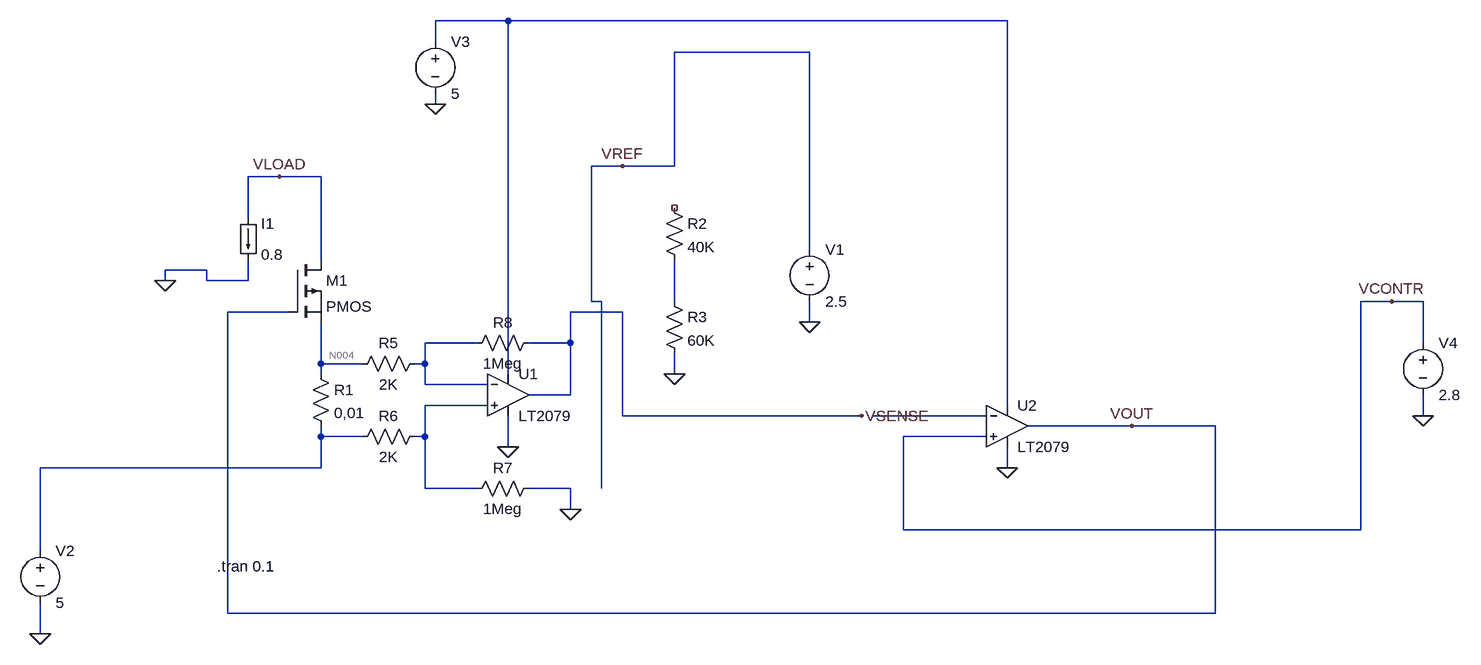
[diagram p0: schematic Draft2.asc]
Draft2.asc, the LTspice schematic file:
Version 4
SHEET 1 1648 680
WIRE 176 -448 64 -448
WIRE 944 -448 176 -448
WIRE 64 -416 64 -448
WIRE 640 -400 432 -400
WIRE 64 -320 64 -336
WIRE 352 -224 304 -224
WIRE 432 -224 432 -400
WIRE 432 -224 352 -224
WIRE -176 -208 -224 -208
WIRE -112 -208 -176 -208
WIRE -224 -144 -224 -208
WIRE 640 -96 640 -400
WIRE -112 -80 -112 -208
WIRE -288 -64 -352 -64
WIRE -352 -48 -352 -64
WIRE -288 -48 -288 -64
WIRE -224 -48 -224 -80
WIRE -224 -48 -288 -48
WIRE 304 -16 304 -224
WIRE 320 -16 304 -16
WIRE 432 -16 432 -80
WIRE 1536 -16 1488 -16
WIRE 1584 -16 1536 -16
WIRE -160 0 -256 0
WIRE 352 0 272 0
WIRE 640 16 640 -16
WIRE 128 48 48 48
WIRE 272 48 272 0
WIRE 272 48 208 48
WIRE 1584 48 1584 -16
WIRE -112 80 -112 16
WIRE -48 80 -112 80
WIRE 48 80 48 48
WIRE 48 80 32 80
WIRE -112 96 -112 80
WIRE 176 96 176 -448
WIRE 432 96 432 64
WIRE 48 112 48 80
WIRE 144 112 48 112
WIRE 272 128 272 48
WIRE 272 128 208 128
WIRE 144 144 48 144
WIRE 944 144 944 -448
WIRE 352 160 352 0
WIRE 720 160 352 160
WIRE 912 160 736 160
WIRE 1584 160 1584 128
WIRE 1136 176 976 176
WIRE 1264 176 1136 176
WIRE -112 192 -112 176
WIRE -48 192 -112 192
WIRE 48 192 48 144
WIRE 48 192 32 192
WIRE 912 192 784 192
WIRE 176 208 176 160
WIRE -112 240 -112 192
WIRE -112 240 -544 240
WIRE 944 240 944 208
WIRE 48 272 48 192
WIRE 128 272 48 272
WIRE 272 272 208 272
WIRE 320 272 320 -16
WIRE 272 304 272 272
WIRE 784 336 784 192
WIRE 1488 336 1488 -16
WIRE 1488 336 784 336
WIRE -544 368 -544 240
WIRE -256 464 -256 0
WIRE 1264 464 1264 176
WIRE 1264 464 -256 464
WIRE -544 496 -544 448
FLAG 176 208 0
FLAG 432 96 0
FLAG -544 496 0
FLAG -352 -48 0
FLAG 640 16 0
FLAG 64 -320 0
FLAG 944 240 0
FLAG 1584 160 0
FLAG 1136 176 VOUT
FLAG 720 160 VSENSE
FLAG 352 -224 VREF
FLAG 1536 -16 VCONTR
FLAG -176 -208 VLOAD
FLAG 272 304 0
SYMBOL res -128 80 R0
SYMATTR InstName R1
SYMATTR Value 0,01
SYMBOL res 416 -176 R0
SYMATTR InstName R2
SYMATTR Value 40K
SYMBOL res 416 -32 R0
SYMATTR InstName R3
SYMATTR Value 60K
SYMBOL voltage 640 -112 R0
WINDOW 123 0 0 Left 0
WINDOW 39 0 0 Left 0
SYMATTR InstName V1
SYMATTR Value 2.5
SYMBOL voltage -544 352 R0
WINDOW 123 0 0 Left 0
WINDOW 39 0 0 Left 0
SYMATTR InstName V2
SYMATTR Value 5
SYMBOL Opamps\\LT2079 176 64 R0
SYMATTR InstName U1
SYMBOL voltage 64 -432 R0
WINDOW 123 0 0 Left 0
WINDOW 39 0 0 Left 0
SYMATTR InstName V3
SYMATTR Value 5
SYMBOL res 48 64 R90
WINDOW 0 0 56 VBottom 2
WINDOW 3 32 56 VTop 2
SYMATTR InstName R5
SYMATTR Value 2K
SYMBOL res 48 176 R90
WINDOW 0 0 56 VBottom 2
WINDOW 3 32 56 VTop 2
SYMATTR InstName R6
SYMATTR Value 2K
SYMBOL res 224 256 R90
WINDOW 0 0 56 VBottom 2
WINDOW 3 32 56 VTop 2
SYMATTR InstName R7
SYMATTR Value 1Meg
SYMBOL res 224 32 R90
WINDOW 0 0 56 VBottom 2
WINDOW 3 32 56 VTop 2
SYMATTR InstName R8
SYMATTR Value 1Meg
SYMBOL Opamps\\LT2079 944 112 R0
SYMATTR InstName U2
SYMBOL voltage 1584 32 R0
WINDOW 123 0 0 Left 0
WINDOW 39 0 0 Left 0
SYMATTR InstName V4
SYMATTR Value 2.8
SYMBOL load -240 -144 R0
WINDOW 123 0 0 Left 0
WINDOW 39 0 0 Left 0
SYMATTR InstName I1
SYMATTR Value 0.8
SYMBOL pmos -160 -80 R0
SYMATTR InstName M1
TEXT -272 392 Left 2 !.tran 0.1

The netlist it stands for:
* Draft2.asc
R1 N004 N007 0,01
R2 NC_01 N002 40K
R3 N002 0 60K
V1 VREF 0 2.5
V2 N007 0 5
XU1 N005 N003 N001 0 VSENSE LT1078  ; LT2079, pins In+ In- V+ V- OUT
V3 N001 0 5
R5 N003 N004 2K
R6 N005 N007 2K
R7 0 N005 1Meg
R8 VSENSE N003 1Meg
XU2 VCONTR N006 N001 0 VOUT LT1078  ; LT2079, pins In+ In- V+ V- OUT
V4 VCONTR 0 2.8
I1 VLOAD 0 0.8
M1 VLOAD VOUT N004 N004 PMOS
.model NMOS NMOS
.model PMOS PMOS
.lib standard.mos
.tran 0.1
.lib LTC.lib
.backanno
.end

* Results of the author's LTspice run, read from the files saved beside the schematic
* Operating Point, zero values left out:
*   V(vload) = -399.9 GV
*   Id(M1) = -800 mA
*   Ib(M1) = 399.9 mA
*   Is(M1) = 400.1 mA
*   I(I1) = 800 mA
*   I(R8) = -4.178 µA
*   I(R7) = -4.99 µA
*   I(R6) = -4.991 µA
*   I(R5) = -4.177 µA
*   I(R1) = -800 mA
*   I(V4) = 7.376 nA
*   I(V3) = -73.23 µA
*   I(V2) = -800 mA
*   Ix(u1:1) = 1.139 nA
*   Ix(u1:2) = -791.4 pA
*   Ix(u1:3) = 36.25 µA
*   Ix(u1:4) = -40.26 µA
*   Ix(u1:5) = 4.178 µA
*   Ix(u2:1) = -7.376 nA
*   Ix(u2:3) = 36.99 µA
*   Ix(u2:4) = -35.95 µA
*   Ix(u2:5) = 4.994 pA
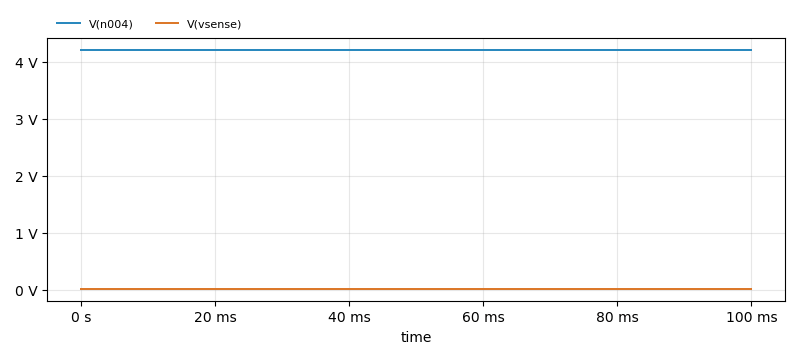
[diagram p1: Transient Analysis of Draft2.asc, plotted from the saved traces]
* Transient Analysis, 1 run:
*   V(n004): min 4.2 V, max 4.2 V, average 4.2 V, rms 4.2 V, last 4.2 V
*   V(vsense): min 13.81 mV, max 13.81 mV, average 13.81 mV, rms 13.81 mV, last 13.81 mV